# Altium project Wenzel_REF.PrjPCB (part 6 of 7)

## Sheet EEM_Connectors.SchDoc: =SheetTitle_Top
size 420 x 297 mm; EDA_Number: ARTIQ; Projet: Sensor Box; SPICEModelCacheVGBTAUBO: <root> / <DocumentId>VGBTAUBO</DocumentId> / <CacheFrame Number="0"> / <Model Name="pk14" Kind="CKT"> / <Text>*.INC dhvqfn.s / .SUBCKT pk14 / +    1   2   3   4   5   6   7   8   9  10 / +   11  12  13  14 / +   15  16  17  18  19  20  21  22  23  24 / +   25  26  27  28 / * Pin Resistance / r1 1 1001 9.078E-02 / r2 2 1002 8.829E-02 / r3 3 1003 8.731E-02 / r4 4 1004 8.710E-02 / r5 5 1005 8.731E-02 / r6 6 1006 8.829E-02 / r7 7 1007 9.075E-02 / r8 8 1008 9.072E-02 / r9 9 1009 8.809E-02 / r10 10 1010 8.716E-02 / r11 11 1011 8.706E-02 / r12 12 1012 8.720E-02 / r13 13 1013 8.816E-02 / r14 14 1014 9.068E-02 / * Pin Inductance / l1 1001 15 2.981E-09 / l2 1002 16 2.447E-09 / l3 1003 17 2.304E-09 / l4 1004 18 2.291E-09 / l5 1005 19 2.307E-09 / l6 1006 20 2.449E-09 / l7 1007 21 2.971E-09 / l8 1008 22 2.972E-09 / l9 1009 23 2.425E-09 / l10 1010 24 2.286E-09 / l11 1011 25 2.280E-09 / l12 1012 26 2.286E-09 / l13 1013 27 2.425E-09 / l14 1014 28 2.975E-09 / .ENDS pk14</Text> / </Model> / </CacheFrame> / </root>; Author: G.Kasprowicz; CompanyName: WUT ISE; DrawnBy: G.Kasprowicz; Organization: WUT ISE; Address1: PW ISE; Address2: Nowowiejska 15/19 00-665 Warsaw; Address3: gkasprow@gmail.com; Revision: 1.1; ModifiedBy: -; CheckedDate: -; Title2: EEM Connectors; DivGrp: WUT ISE; Designer: G.Kasprowicz; ModifiedDate: -; ProjectName: Sensor Box
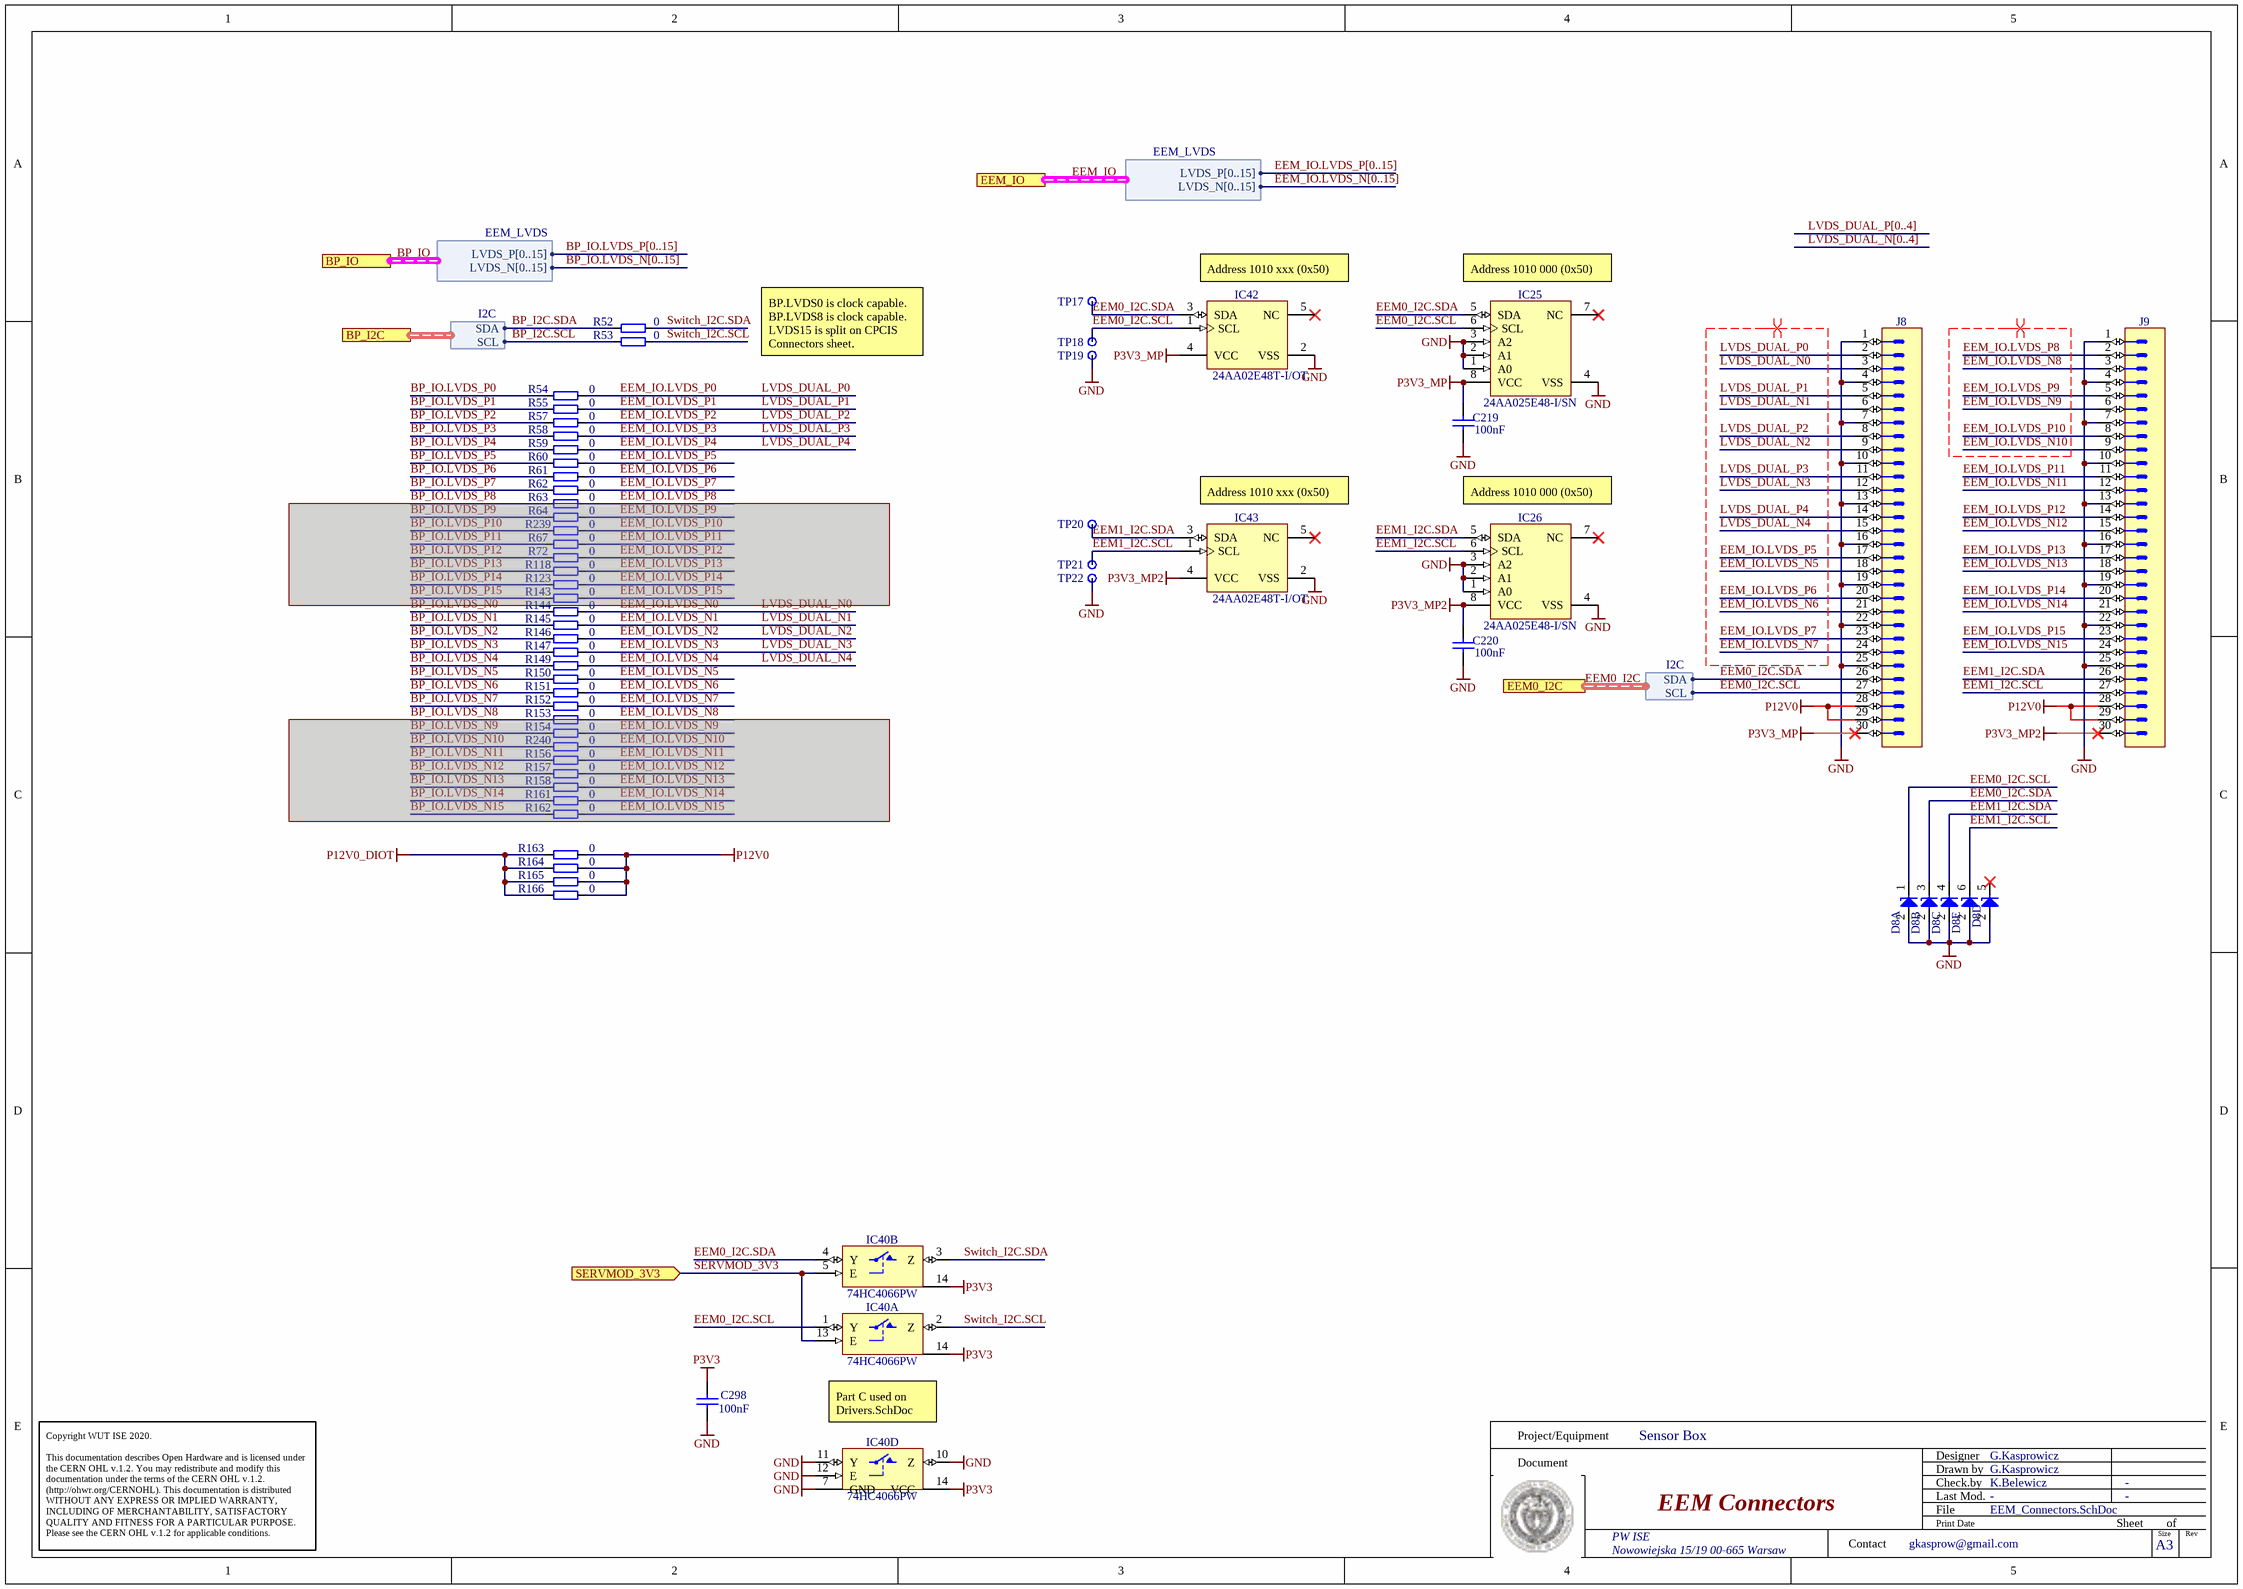
[diagram p8: EEM_Connectors.SchDoc]

### Parts
(Parts that share a designator on the sheet are numbered #1, #2 ... from top to bottom, then left to right.)
C219  100nF  [CAPC1005X55N]
C220  100nF  [CAPC1005X55N]
C298  100nF  [CAPC1005X55N]
D8  PESD3V3L5UY  [SOT65P210X110-6N]  (value not drawn)  (parts A,B,C,D,E of 5)
IC25  24AA025E48-I/SN  [SOIC127P600X175-8N]
IC26  24AA025E48-I/SN  [SOIC127P600X175-8N]
IC40  74HC4066PW  [SOP65P640X110-14N]  (parts A,B,D of 4)
IC42  24AA02E48T-I/OT  [SOT95P280X145-5N]
IC43  24AA02E48T-I/OT  [SOT95P280X145-5N]
J8  (no value)  [3M_N2530-6002RB]
J9  (no value)  [3M_N2530-6002RB]
R52  0  [RESC1005X40N]
R53  0  [RESC1005X40N]
R54  0  [RESC1005X40N]
R55  0  [RESC1005X40N]
R57  0  [RESC1005X40N]
R58  0  [RESC1005X40N]
R59  0  [RESC1005X40N]
R60  0  [RESC1005X40N]
R61  0  [RESC1005X40N]
R62  0  [RESC1005X40N]
R63  0  [RESC1005X40N]  (masked out: inside a compile mask, not in the netlist)
R64  0  [RESC1005X40N]  (masked out: inside a compile mask, not in the netlist)
R67#2  0  [RESC1005X40N]  (masked out: inside a compile mask, not in the netlist)
R72#3  0  [RESC1005X40N]  (masked out: inside a compile mask, not in the netlist)
R118#3  0  [RESC1005X40N]  (masked out: inside a compile mask, not in the netlist)
R123#2  0  [RESC1005X40N]  (masked out: inside a compile mask, not in the netlist)
R143#2  0  [RESC0603X28N]  (masked out: inside a compile mask, not in the netlist)
R144  0  [RESC1005X40N]
R145  0  [RESC1005X40N]
R146  0  [RESC1005X40N]
R147  0  [RESC1005X40N]
R149  0  [RESC1005X40N]
R150  0  [RESC1005X40N]
R151  0  [RESC1005X40N]
R152  0  [RESC1005X40N]
R153  0  [RESC1005X40N]  (masked out: inside a compile mask, not in the netlist)
R154  0  [RESC1005X40N]  (masked out: inside a compile mask, not in the netlist)
R156#1  0  [RESC1005X40N]  (masked out: inside a compile mask, not in the netlist)
R157#1  0  [RESC1005X40N]  (masked out: inside a compile mask, not in the netlist)
R158#1  0  [RESC1005X40N]  (masked out: inside a compile mask, not in the netlist)
R161#1  0  [RESC1005X40N]  (masked out: inside a compile mask, not in the netlist)
R162#1  0  [RESC0603X28N]  (masked out: inside a compile mask, not in the netlist)
R163  0  [RESC1005X40N]
R164  0  [RESC1005X40N]
R165  0  [RESC1005X40N]
R166  0  [RESC1005X40N]
R239  0  [RESC1005X40N]  (masked out: inside a compile mask, not in the netlist)
R240  0  [RESC1005X40N]  (masked out: inside a compile mask, not in the netlist)
TP17  Test Point  [TPS127]  (value not drawn)  (no BOM)
TP18  Test Point  [TPS127]  (value not drawn)  (no BOM)
TP19  Test Point  [TPS127]  (value not drawn)  (no BOM)
TP20  Test Point  [TPS127]  (value not drawn)  (no BOM)
TP21  Test Point  [TPS127]  (value not drawn)  (no BOM)
TP22  Test Point  [TPS127]  (value not drawn)  (no BOM)

### Ports
BP_I2C (harness I2C), BP_IO (harness EEM_LVDS), EEM0_I2C (harness I2C), EEM_IO (harness EEM_LVDS), SERVMOD_3V3 (in)

### Harnesses
I2C: SDA, SCL
EEM_LVDS: LVDS_P[0..15], LVDS_N[0..15]

### Nets
GND: C219.1 C220.1 C298.1 D8.2(A) IC25.1(A0) IC25.2(A1) IC25.3(A2) IC25.4(VSS) IC26.1(A0) IC26.2(A1) IC26.3(A2) IC26.4(VSS) IC40.7(GND) IC40.10(Z) IC40.11(Y) IC40.12(E) IC42.2(VSS) IC43.2(VSS) J8.1 J8.4 J8.7 J8.10 J8.13 J8.16 J8.19 J8.22 J8.25 J9.1 J9.4 J9.7 J9.10 J9.13 J9.16 J9.19 J9.22 J9.25 TP19.1 TP22.1
P3V3: C298.2 IC40.14(VCC)
P3V3_MP: C219.2 IC25.8(VCC) IC42.4(VCC) J8.30
P3V3_MP2: C220.2 IC26.8(VCC) IC43.4(VCC) J9.30
P12V0: J8.28 J8.29 J9.28 J9.29 R163.2 R164.2 R165.2 R166.2
P12V0_DIOT: R163.1 R164.1 R165.1 R166.1
BP_I2C.SCL: R53.1 ; port BP_I2C.SCL
BP_I2C.SDA: R52.1 ; port BP_I2C.SDA
BP_IO.LVDS_N0: R144.1
BP_IO.LVDS_N1: R145.1
BP_IO.LVDS_N2: R146.1
BP_IO.LVDS_N3: R147.1
BP_IO.LVDS_N4: R149.1
BP_IO.LVDS_N5: R150.1
BP_IO.LVDS_N6: R151.1
BP_IO.LVDS_N7: R152.1
BP_IO.LVDS_P0: R54.1
BP_IO.LVDS_P1: R55.1
BP_IO.LVDS_P2: R57.1
BP_IO.LVDS_P3: R58.1
BP_IO.LVDS_P4: R59.1
BP_IO.LVDS_P5: R60.1
BP_IO.LVDS_P6: R61.1
BP_IO.LVDS_P7: R62.1
EEM0_I2C.SCL: D8.1(C) IC25.6(SCL) IC40.1(Y) IC42.1(SCL) J8.27 TP18.1 ; port EEM0_I2C.SCL
EEM0_I2C.SDA: D8.3(C) IC25.5(SDA) IC40.4(Y) IC42.3(SDA) J8.26 TP17.1 ; port EEM0_I2C.SDA
EEM1_I2C.SCL: D8.6(C) IC26.6(SCL) IC43.1(SCL) J9.27 TP21.1
EEM1_I2C.SDA: D8.4(C) IC26.5(SDA) IC43.3(SDA) J9.26 TP20.1
EEM_IO.LVDS_N0: J8.3 R144.2  [also labelled LVDS_DUAL_N0]
EEM_IO.LVDS_N1: J8.6 R145.2  [also labelled LVDS_DUAL_N1]
EEM_IO.LVDS_N2: J8.9 R146.2  [also labelled LVDS_DUAL_N2]
EEM_IO.LVDS_N3: J8.12 R147.2  [also labelled LVDS_DUAL_N3]
EEM_IO.LVDS_N4: J8.15 R149.2  [also labelled LVDS_DUAL_N4]
EEM_IO.LVDS_N5: J8.18 R150.2
EEM_IO.LVDS_N6: J8.21 R151.2
EEM_IO.LVDS_N7: J8.24 R152.2
EEM_IO.LVDS_N8: J9.3  [project net DELAY_Q1_N]
EEM_IO.LVDS_N9: J9.6
EEM_IO.LVDS_N10: J9.9
EEM_IO.LVDS_N11: J9.12
EEM_IO.LVDS_N12: J9.15
EEM_IO.LVDS_N13: J9.18
EEM_IO.LVDS_N14: J9.21
EEM_IO.LVDS_N15: J9.24
EEM_IO.LVDS_P0: J8.2 R54.2  [also labelled LVDS_DUAL_P0]
EEM_IO.LVDS_P1: J8.5 R55.2  [also labelled LVDS_DUAL_P1]
EEM_IO.LVDS_P2: J8.8 R57.2  [also labelled LVDS_DUAL_P2]
EEM_IO.LVDS_P3: J8.11 R58.2  [also labelled LVDS_DUAL_P3]
EEM_IO.LVDS_P4: J8.14 R59.2  [also labelled LVDS_DUAL_P4]
EEM_IO.LVDS_P5: J8.17 R60.2
EEM_IO.LVDS_P6: J8.20 R61.2
EEM_IO.LVDS_P7: J8.23 R62.2
EEM_IO.LVDS_P8: J9.2  [project net DELAY_Q1_P]
EEM_IO.LVDS_P9: J9.5
EEM_IO.LVDS_P10: J9.8
EEM_IO.LVDS_P11: J9.11
EEM_IO.LVDS_P12: J9.14
EEM_IO.LVDS_P13: J9.17
EEM_IO.LVDS_P14: J9.20
EEM_IO.LVDS_P15: J9.23
SERVMOD_3V3: IC40.5(E) IC40.13(E) ; port SERVMOD_3V3
Switch_I2C.SCL: IC40.2(Z) R53.2
Switch_I2C.SDA: IC40.3(Z) R52.2

Not connected (* = marked no-connect by the designer): D8 5(C)*; IC25 7(NC)*; IC26 7(NC)*; IC42 5(NC)*; IC43 5(NC)*

### Buses and harness runs
bus BP_IO.LVDS_N[0..15]
bus BP_IO.LVDS_P[0..15]
bus EEM_IO.LVDS_N[0..15]
bus EEM_IO.LVDS_P[0..15]
bus LVDS_DUAL_N[0..4]
bus LVDS_DUAL_P[0..4]
harness BP_IO = port BP_IO
harness EEM0_I2C = port EEM0_I2C
harness EEM_IO = port EEM_IO

### Layout directives
differential pair; differential pair class Diff_100Ohm: EEM_IO.LVDS_N5, EEM_IO.LVDS_N6, EEM_IO.LVDS_N7, EEM_IO.LVDS_N8, EEM_IO.LVDS_N9, EEM_IO.LVDS_N10, EEM_IO.LVDS_P5, EEM_IO.LVDS_P6, EEM_IO.LVDS_P7, EEM_IO.LVDS_P8, EEM_IO.LVDS_P9, EEM_IO.LVDS_P10, LVDS_DUAL_N0, LVDS_DUAL_N1, LVDS_DUAL_N2, LVDS_DUAL_N3, LVDS_DUAL_N4, LVDS_DUAL_P0, LVDS_DUAL_P1, LVDS_DUAL_P2, LVDS_DUAL_P3, LVDS_DUAL_P4

### Notes on the sheet
- (near IC42) Address 1010 xxx (0x50)
- (near IC25) Address 1010 000 (0x50)
- BP.LVDS0 is clock capable.
  BP.LVDS8 is clock capable.
  LVDS15 is split on CPCIS Connectors sheet.
- (near IC43) Address 1010 xxx (0x50)
- Address 1010 000 (0x50)
- (near IC40) Part C used on Drivers.SchDoc
- Project/Equipment
- Document
- Designer
- Drawn by
- Check.by
- Copyright WUT ISE 2020.
  This documentation describes Open Hardware and is licensed under the CERN OHL v.1.2. You may redistribute and modify this documentation under the terms of the CERN OHL v.1.2. (http://ohwr.org/CERNOHL). This documentation is distributed WITHOUT ANY EXPRESS OR IMPLIED WARRANTY, INCLUDING OF MERCHANTABILITY, SATISFACTORY QUALITY AND FITNESS FOR A PARTICULAR PURPOSE. Please see the CERN OHL v.1.2 for applicable conditions.
- Contact
- File
- Last Mod.
- Print Date
- Sheet
- Size
- A3
- of
- Rev

### Library data of the parts
C219 C220 C298 = CC0402_100NF_16V_10%_X5R: as C1 on sheet CPCIS_Connectors; Part Number: CC0402_100NF_16V_10%_X5R; Component Kind: Standard; Component Type: Standard; Pin Count: 2; Value: 100nF; Status: None; Manufacturer Part Number: CC0402_100NF_16V_10%_X5R; Case: 0402; Mounted: Yes; Socket: No; SMD: Yes; Sense: No; Manufacturer1 Example: MURATA; Manufacturer1 ComponentHeight: 0.55mm; HelpURL: \\cern.ch\dfs\Applications\Altium\Datasheets\CC0402_X5R_MURATA_GRM.pdf; Author: CERN DEM JLC; CreateDate: 10.12.2013; LatestRevisionDate: 10.12.2013
D8 = PESD3V3L5UY: as D5 on sheet CPCIS_Connectors; Part Number: PESD3V3L5UY; Component Kind: Standard; Component Type: Standard; Device: PESD3V3L5UY; PackageDescription: SOT363, SC-88, 0.65mm Pitch; 6 Pin, 1.25mm W X 2.00mm L X 1.10mm H body, IPC Medium Density; Manufacturer Part Number: PESD3V3L5UY; Pin Count: 6; Case: SOT363; Mounted: Yes; Socket: No; SMD: Yes; Sense: No; ComponentHeight: 1.1mm; HelpURL: \\cern.ch\dfs\Applications\Altium\Datasheets\PESD3V3L5UY.pdf; Author: CERN DEM WB; CreateDate: 05.07.2021; LatestRevisionDate: 05.07.2021
IC25 IC26 = 24AA025E48-I/SN: 1.7V-5.5V, 2K I2C™ Serial EEPROMs with EUI-48™ Node Identity; Manufacturer: MICROCHIP TECHNOLOGY; PressFit: No; Bonding: No; Part Number: 24AA025E48-I/SN; Component Kind: Standard; Component Type: Standard; Device: 24AA025E48-I/SN; PackageDescription: SOIC 8, Pitch 1.27mm - Body 4x5mm, IPC Medium Density; Part Description: 1.7V-5.5V, 2K I2C™ Serial EEPROMs with EUI-48™ Node Identity; Manufacturer Part Number: 24AA025E48-I/SN; Pin Count: 8; Case: SOIC8; Mounted: Yes; Socket: No; SMD: Yes; Sense: No; ComponentHeight: 1.75mm; HelpURL: \\cern.ch\dfs\Applications\Altium\Datasheets\24AA025E48-I-SN.pdf; Author: CERN DEM MR; CreateDate: 19.07.2016; LatestRevisionDate: 19.07.2016
IC40 = 74HC4066PW: as IC6 on sheet CPCIS_Connectors; Part Number: 74HC4066PW; Component Kind: Standard; Component Type: Standard; Device: 74HC4066PW; PackageDescription: SOP, 14-Leads, Body 4.4x5mm (max), Pitch 0.65mm, IPC Medium Density; Manufacturer Part Number: 74HC4066PW; Pin Count: 14; Case: TSSOP14; Mounted: Yes; Socket: No; SMD: Yes; ComponentHeight: 1.1mm; Author: CERN DEM JLC; HelpURL: \\cern.ch\dfs\Applications\Altium\Datasheets\74HC4066PW.pdf; CreateDate: 2014-11-19; LatestRevisionDate: 2014-11-19
IC42 IC43 = 24AA02E48T-I/OT: 1.7V-5.5V, 2K I2C Serial EEPROM With EUI-48 Node Identity; Manufacturer: MICROCHIP TECHNOLOGY; PressFit: No; Bonding: No; Part Number: 24AA02E48T-I/OT; Component Kind: Standard; Component Type: Standard; Device: 24AA02E48T-I/OT; PackageDescription: SOT, 0.95mm pitch; 5 pin, 1.60mm W X 2.90mm L X 1.45mm H body, IPC Medium Density; Part Description: 1.7V-5.5V, 2K I2C Serial EEPROM With EUI-48 Node Identity; Manufacturer Part Number: 24AA02E48T-I/OT; Pin Count: 5; Case: SOT23-5; Mounted: Yes; Socket: No; SMD: Yes; Sense: No; ComponentHeight: 1.45mm; HelpURL: \\cern.ch\dfs\Applications\Altium\Datasheets\24AA02E48T-I-OT.pdf; Author: CERN DEM MR; CreateDate: 31.03.2016; LatestRevisionDate: 31.03.2016
J8 J9 = 3M_N2530-6002RB: Connector 30 Male; Part Description: 30 Contacts - Straight .100'' x .100'' Low Profile Four-Wall Header, 2500 Series; Manufacturer: 3M; PressFit: No; Part Number: 3M_N2530-6002RB; Component Kind: Standard; Component Type: Standard; Pin Count: 30; Family: Header 30; Mounted: Yes; Socket: No; SMD: No; Sense: No; Status: None; Manufacturer Part Number: N2530-6002RB; ComponentHeight: 10.03mm; HelpURL: \\cern.ch\dfs\Applications\Altium\Datasheets\3M_N2530-6002RB.pdf; Author: CERN DEM JLC; CreateDate: 11.02.2009; LatestRevisionDate: 11.08.2009
R52-R55 R57-R64 R67#2 R72#3 R118#3 R123#2 R144-R147 R149-R154 R156#1 R157#1 R158#1 R161#1 R163-R166 R239 R240 = R0402_0R_JUMPER: Resistor; Part Description: 1A (0.05R Max DC Resistance) Zero Ohm Jumper; Manufacturer: GENERIC; Manufacturer1 Part Number: 232270591001L; PressFit: No; Part Number: R0402_0R_JUMPER; Component Kind: Standard; Component Type: Standard; Pin Count: 2; Value: 0; Status: Not Recommended; Manufacturer Part Number: R0402_0R_JUMPER; Case: 0402; Mounted: Yes; Sense: No; Socket: No; SMD: Yes; Manufacturer1 Example: YAGEO PHYCOMP; Manufacturer1 ComponentHeight: 0.4mm; HelpURL: \\cern.ch\dfs\Applications\Altium\Datasheets\R0402_Phycomp_RC0402.pdf; Author: CERN DEM JLC; CreateDate: 03.12.2007; LatestRevisionDate: 17.10.2012
R143#2 R162#1 = R0201_0R_JUMPER: as R10 on sheet CPCIS_Connectors; Part Number: R0201_0R_JUMPER; Component Kind: Standard; Component Type: Standard; Pin Count: 2; Value: 0; Status: Not Recommended; Manufacturer Part Number: R0201_0R_JUMPER; Case: 0201; Mounted: Yes; Sense: No; Socket: No; SMD: Yes; Manufacturer1 Example: VISHAY; Manufacturer1 ComponentHeight: 0.27mm; HelpURL: \\cern.ch\dfs\Applications\Altium\Datasheets\R0201_VISHAY_CRCW e3.pdf; Author: CERN DEM JLC; CreateDate: 2014-11-19; LatestRevisionDate: 2015-01-08
TP17-TP22 = SMD_PAD_1.27X1.27MM: Part Description: 1.27mm x 1.27mm PCB Copper Area (SMD Test Point); Mounted: No; Part Number: SMD_PAD_1.27X1.27MM; Component Type: Standard (No BOM); Pin Count: 1; Family: Test Point; Socket: No; SMD: Yes; Sense: No; Status: None; ComponentHeight: 0mm; HelpURL: Undefined; Author: CERN DEM JLC; CreateDate: 12.01.2008; LatestRevisionDate: 12.01.2008; PackageDescription: 1.27mm x 1.27mm PCB Copper Area (SMD Test Point)

## Sheet PLL.SchDoc: =SheetTitle_Top
size 420 x 297 mm; Author: G.Kasprowicz; CompanyName: WUT ISE; DrawnBy: G.Kasprowicz; Organization: WUT ISE; Address1: PW ISE; Address2: Nowowiejska 15/19 00-665 Warsaw; Address3: gkasprow@gmail.com; Revision: 1.1; ModifiedBy: -; CheckedDate: -; Title2: PLL; DivGrp: WUT ISE; Designer: G.Kasprowicz; ModifiedDate: -; ProjectName: Sensor Box
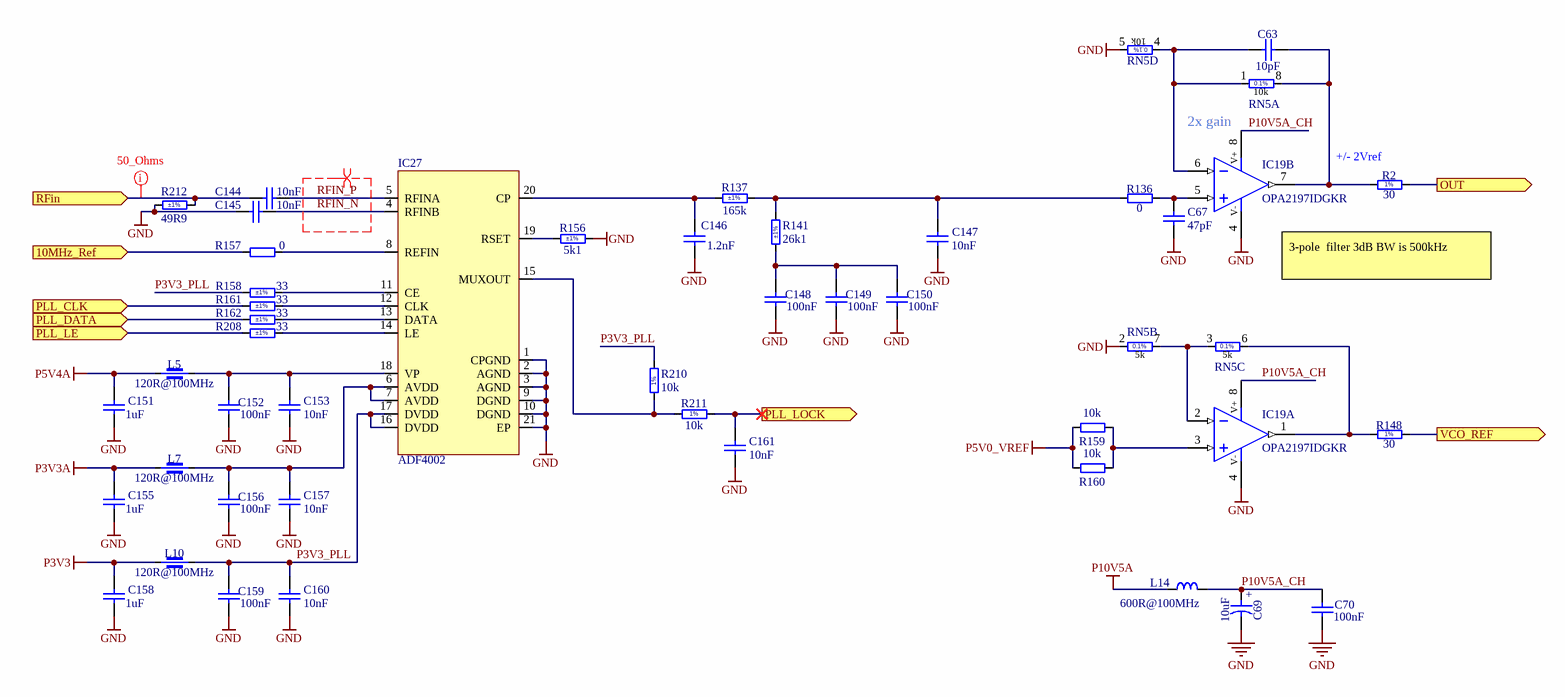
[diagram p9: PLL.SchDoc]

### Parts
(Parts that share a designator on the sheet are numbered #1, #2 ... from top to bottom, then left to right.)
C63  10pF  [CAPC1005X55N]
C67  47pF  [CAPC1005X55N]
C69  10uF  [CAPMP3216X180N]
C70  100nF  [CAPC1005X55N]
C144  10nF  [CAPC1005X55N]
C145  10nF  [CAPC1005X55N]
C146  1.2nF  [CAPC1608X87N]
C147  10nF  [CAPC1608X87N]
C148  100nF  [CAPC1005X55N]
C149  100nF  [CAPC1005X55N]
C150  100nF  [CAPC1005X55N]
C151  1uF  [CAPC1005X55N]
C152  100nF  [CAPC1005X55N]
C153  10nF  [CAPC1005X55N]
C155  1uF  [CAPC1005X55N]
C156  100nF  [CAPC1005X55N]
C157  10nF  [CAPC1005X55N]
C158  1uF  [CAPC1005X55N]
C159  100nF  [CAPC1005X55N]
C160  10nF  [CAPC1005X55N]
C161  10nF  [CAPC1005X55N]
IC19  OPA2197IDGKR  [SOP65P490X110-8N]  (parts A,B of 2)
IC27  ADF4002  [CP_20_1_ADI]
L5  120R@100MHz  [INDC1608X65N]
L7  120R@100MHz  [INDC1608X65N]
L10  120R@100MHz  [INDC1608X65N]
L14  600R@100MHz  [INDC1005X55N]
R2  30  [RESC1608X55N]
R136  0  [RESC1005X40N]
R137#2  165k  Tolerance: ±1%  [RESC1608X55N]
R141  26k1  Tolerance: ±1%  [RESC1608X55N]
R148  30  [RESC1608X55N]
R156#2  5k1  Tolerance: ±1%  [RESC1608X55N]
R157#2  0  [RESC1005X40N]
R158#2  33  Tolerance: ±1%  [RESC1005X40N]
R159  10k  [RESC1608X55N]
R160  10k  [RESC1608X55N]
R161#2  33  Tolerance: ±1%  [RESC1005X40N]
R162#2  33  Tolerance: ±1%  [RESC1005X40N]
R208#2  33  Tolerance: ±1%  [RESC1005X40N]
R210  10k  [RESC1005X40N]
R211#2  10k  [RESC1005X40N]
R212#2  49R9  Tolerance: ±1%  [RESC1005X40N]
RN5  10k 5K 5K 10K  [SOIC127P600X175-8N]  (value not drawn)  (parts A,B,C,D of 4)

### Ports
10MHz_Ref (in), OUT (out), PLL_CLK (in), PLL_DATA (in), PLL_LE (in), PLL_LOCK (out), RFin (in), VCO_REF (out)

### Nets
GND: C67.2 C69.2 C70.1 C145.1 C146.1 C147.1 C148.1 C149.1 C150.1 C151.1 C152.1 C153.1 C155.1 C156.1 C157.1 C158.1 C159.1 C160.1 C161.2 IC19.4(V-) IC27.1(CPGND) IC27.2(AGND) IC27.3(AGND) IC27.9(DGND) IC27.10(DGND) IC27.21(EP) R156#2.2 R212#2.1 RN5.2 RN5.5
P3V3: C158.2 L10.1
P3V3A: C155.2 L7.1
P5V0_VREF: R159.2 R160.2
P5V4A: C151.2 L5.1
P10V5A: L14.1
10MHz_Ref: R157#2.1 ; port 10MHz_Ref
D4: C161.1 R211#2.2 ; port PLL_LOCK
D11: R208#2.1 ; port PLL_LE
D15 (SCK): R161#2.1 ; port PLL_CLK
P3V3_PLL: C159.2 C160.2 IC27.16(DVDD) IC27.17(DVDD) L10.2 R158#2.1 R210.2
P10V5A_CH: C69.1 C70.2 IC19.8(V+) L14.2
PLL_MOSI: R162#2.1 ; port PLL_DATA
RF_100M: C144.1 R212#2.2 ; port RFin
RFIN_N: C145.2 IC27.4(RFINB)
RFIN_P: C144.2 IC27.5(RFINA)
VCO_IN: R2.2 ; port OUT
VCO_REF_IN: R148.2 ; port VCO_REF
NetC63_1: C63.1 IC19.6(IN-) RN5.1 RN5.4
NetC63_2: C63.2 IC19.7(OUT) R2.1 RN5.8
NetC67_1: C67.1 IC19.5(IN+) R136.2
NetC146_2: C146.2 IC27.20(CP) R137#2.1
NetC147_2: C147.2 R136.1 R137#2.2 R141.2
NetC148_2: C148.2 C149.2 C150.2 R141.1
NetC152_2: C152.2 C153.2 IC27.18(VP) L5.2
NetC156_2: C156.2 C157.2 IC27.6(AVDD) IC27.7(AVDD) L7.2
NetIC19_1: IC19.1(OUT) R148.1 RN5.6
NetIC19_2: IC19.2(IN-) RN5.3 RN5.7
NetIC19_3: IC19.3(IN+) R159.1 R160.1
NetIC27_8: IC27.8(REFIN) R157#2.2
NetIC27_11: IC27.11(CE) R158#2.2
NetIC27_12: IC27.12(CLK) R161#2.2
NetIC27_13: IC27.13(DATA) R162#2.2
NetIC27_14: IC27.14(LE) R208#2.2
NetIC27_15: IC27.15(MUXOUT) R210.1 R211#2.1
NetIC27_19: IC27.19(RSET) R156#2.1

### Layout directives
differential pair: RFIN_N, RFIN_P
net class 50_Ohms: RF_100M

### Notes on the sheet
- 2x gain
- (near R2) +/- 2Vref
- (near IC19) 3-pole  filter 3dB BW is 500kHz
- Project/Equipment
- Document
- Designer
- Drawn by
- Check.by
- Copyright WUT ISE 2020.
  This documentation describes Open Hardware and is licensed under the CERN OHL v.1.2. You may redistribute and modify this documentation under the terms of the CERN OHL v.1.2. (http://ohwr.org/CERNOHL). This documentation is distributed WITHOUT ANY EXPRESS OR IMPLIED WARRANTY, INCLUDING OF MERCHANTABILITY, SATISFACTORY QUALITY AND FITNESS FOR A PARTICULAR PURPOSE. Please see the CERN OHL v.1.2 for applicable conditions.
- Contact
- File
- Last Mod.
- Print Date
- Sheet
- Size
- A3
- of
- Rev
- (in symbol CTE3216-18_10UF_16V_20%_AVX_TCJ) +
- (in symbol R0402_10K_1%_0.0625W_100PPM) 1%
- (in symbol R0603_30R_1%_0.1W_100PPM) 1%
- (in symbol RN_10K_5K_VISHAY_AORN2-1AT3, part A) 10k
- (in symbol RN_10K_5K_VISHAY_AORN2-1AT3, part B) 5k
- (in symbol RN_10K_5K_VISHAY_AORN2-1AT3, part C) 5k
- (in symbol RN_10K_5K_VISHAY_AORN2-1AT3, part D) 10k

### Library data of the parts
C63 = CC0402_10PF_50V_5%_C0G: Non-polarised capacitor; Part Description: SMD Multilayer Chip Ceramic Capacitor; Manufacturer: GENERIC; Manufacturer1 Part Number: C0402C100J5GACTU; Voltage: 50V; TC: C0G/NP0; Tolerance: ±5%; Part Number: CC0402_10PF_50V_5%_C0G; Component Kind: Standard; Component Type: Standard; Pin Count: 2; Value: 10pF; Status: Preferred; Manufacturer Part Number: CC0402_10PF_50V_5%_C0G; Case: 0402; Mounted: Yes; Socket: No; SMD: Yes; Sense: No; Manufacturer1 Example: KEMET; Manufacturer1 ComponentHeight: 0.55mm; HelpURL: \\cern.ch\dfs\Applications\Altium\Datasheets\CC0805_C0G_KEMET_(Commercial Grade).pdf; Author: CERN DEM JLC; CreateDate: 03.12.2007; LatestRevisionDate: 22.04.2015
C67 = CC0402_47PF_50V_1%_C0G_MURATA_GJM1555C1H470FB01D: Non-polarised capacitor; Part Description: High-Q SMD Chip Monolithic Ceramic Capacitor; Manufacturer: MURATA; Voltage: 50V; TC: C0G/NP0; Tolerance: ±1%; Part Number: CC0402_47PF_50V_1%_C0G_MURATA_GJM1555C1H470FB01D; Component Kind: Standard; Component Type: Standard; Pin Count: 2; Value: 47pF; Status: None; Manufacturer Part Number: GJM1555C1H470FB01D; Case: 0402; Mounted: Yes; Socket: No; SMD: Yes; Sense: No; ComponentHeight: 0.55mm; HelpURL: \\cern.ch\dfs\Applications\Altium\Datasheets\CC0402_MURATA_GJM1555C1H470FB01D.pdf; Author: CERN DEM BC; CreateDate: 20.11.2017; LatestRevisionDate: 20.11.2017
C69 = CTE3216-18_10UF_16V_20%_AVX_TCJ: Polarised capacitor; Part Description: ESR 0R200 Tantalum Solid Electrolytic Chip Capacitor with Conductive Polymer Electrode; Manufacturer: AVX; Manufacturer Part Number: TCJA106M016R0200 or  or TR3A106K016C1700; Voltage: 16V; Tolerance: ±20%; Part Number: CTE3216-18_10UF_16V_20%_AVX_TCJ; Component Kind: Standard; Component Type: Standard; Pin Count: 2; Value: 10uF; Status: Preferred; Case: A; Mounted: Yes; Socket: No; SMD: Yes; Sense: No; ComponentHeight: 1.8mm; HelpURL: \\cern.ch\dfs\Applications\Altium\Datasheets\CTE_AVX_TCJ.pdf; Author: CERN DEM JLC; CreateDate: 29.03.2012; LatestRevisionDate: 29.03.2012
C70 C148-C150 C152 C156 C159 = CC0402_100NF_16V_10%_X5R: as C1 on sheet CPCIS_Connectors; Part Number: CC0402_100NF_16V_10%_X5R; Component Kind: Standard; Component Type: Standard; Pin Count: 2; Value: 100nF; Status: None; Manufacturer Part Number: CC0402_100NF_16V_10%_X5R; Case: 0402; Mounted: Yes; Socket: No; SMD: Yes; Sense: No; Manufacturer1 Example: MURATA; Manufacturer1 ComponentHeight: 0.55mm; HelpURL: \\cern.ch\dfs\Applications\Altium\Datasheets\CC0402_X5R_MURATA_GRM.pdf; Author: CERN DEM JLC; CreateDate: 10.12.2013; LatestRevisionDate: 10.12.2013
C144 C145 C153 C157 C160 C161 = CC0402_10NF_16V_10%_X7R: Non-polarised capacitor; Part Description: SMD Multilayer Chip Ceramic Capacitor; Manufacturer: GENERIC; Manufacturer1 Part Number: 223878715636; Voltage: 16V; TC: X7R; Tolerance: ±10%; Part Number: CC0402_10NF_16V_10%_X7R; Component Kind: Standard; Component Type: Standard; Pin Count: 2; Value: 10nF; Status: Not Recommended; Manufacturer Part Number: CC0402_10NF_16V_10%_X7R; Case: 0402; Mounted: Yes; Socket: No; SMD: Yes; Sense: No; Manufacturer1 Example: PHYCOMP; Manufacturer1 ComponentHeight: 0.55mm; HelpURL: \\cern.ch\dfs\Applications\Altium\Datasheets\CC0402_X7R_PHYCOMP.pdf; Author: CERN DEM JLC; CreateDate: 03.12.2007; LatestRevisionDate: 03.12.2007
C146 = CC0603_1.2NF_50V_1%_C0G: Non-polarised capacitor; Part Description: SMD Multilayer Chip Ceramic Capacitor; Manufacturer: GENERIC; Manufacturer1 Part Number: C0603C122F5GACTU; Voltage: 50V; TC: C0G/NP0; Tolerance: ±1%; Part Number: CC0603_1.2NF_50V_1%_C0G; Component Kind: Standard; Component Type: Standard; Pin Count: 2; Value: 1.2nF; Status: None; Manufacturer Part Number: CC0603_1.2NF_50V_1%_C0G; Case: 0603; Mounted: Yes; Socket: No; SMD: Yes; Sense: No; Manufacturer1 Example: KEMET; Manufacturer1 ComponentHeight: 0.87mm; HelpURL: \\cern.ch\dfs\Applications\Altium\Datasheets\CC0603_C0G_KEMET_(Commercial Grade).pdf; Author: CERN DEM BC; CreateDate: 21/05/2019; LatestRevisionDate: 21/05/2019
C147 = CC0603_10NF_50V_5%_C0G: Non-polarised capacitor; Part Description: SMD Multilayer Chip Ceramic Capacitor; Manufacturer: GENERIC; Manufacturer1 Part Number: C1608C0G1H103J080AA; Voltage: 50V; TC: C0G/NP0; Tolerance: ±5%; Part Number: CC0603_10NF_50V_5%_C0G; Component Kind: Standard; Component Type: Standard; Pin Count: 2; Value: 10nF; Status: Preferred; Manufacturer Part Number: CC0603_10NF_50V_5%_C0G; Case: 0603; Mounted: Yes; Socket: No; SMD: Yes; Sense: No; Manufacturer1 Example: TDK; Manufacturer1 ComponentHeight: 0.9mm; HelpURL: \\cern.ch\dfs\Applications\Altium\Datasheets\CC0603_C0G_TDK_C.pdf; Author: CERN DEM JLC; CreateDate: 10/12/2014; LatestRevisionDate: 10/12/2014
C151 C155 C158 = CC0402_1UF_16V_10%_X5R: as C12 on sheet CPCIS_Connectors; Part Number: CC0402_1UF_16V_10%_X5R; Component Kind: Standard; Component Type: Standard; Pin Count: 2; Value: 1uF; Status: Preferred; Manufacturer Part Number: CC0402_1UF_16V_10%_X5R; Case: 0402; Mounted: Yes; Socket: No; SMD: Yes; Sense: No; Manufacturer1 Example: TDK; Manufacturer1 ComponentHeight: 0.55mm; HelpURL: \\cern.ch\dfs\Applications\Altium\Datasheets\CC0402_X5R_TDK_C.pdf; Author: CERN DEM JLC; CreateDate: 2012-10-25; LatestRevisionDate: 2012-10-25
IC19 = OA_OPA2197IDGKR: 36-V, Precision, Rail-to-Rail Input Output, Low Offset Voltage Op Amp 8-VSSOP; Part Description: High-Precision, Low-Noise, Rail-to-Rail Output,10-MHz Op Amp; Manufacturer: TEXAS INSTRUMENTS; PressFit: No; Bonding: No; Part Number: OPA2197IDGKR; Component Kind: Standard; Component Type: Standard; Device: OPA2197IDGKR; PackageDescription: SOP, 0.65mm pitch; 8 pin, 3.00mm W X 3.00mm L X 1.10mm H body, IPC Medium Density; Manufacturer Part Number: OPA2197IDGKR; Pin Count: 8; Case: MSOP8; Mounted: Yes; Socket: No; SMD: Yes; Sense: No; ComponentHeight: 1.1mm; Author: GK; HelpURL: \\cern.ch\dfs\Applications\Altium\Datasheets\OPA2140AIDGK.pdf; CreateDate: 20.04.2017; LatestRevisionDate: 20.04.2017
IC27 = ADF4002BCPZ-RL7: No Description Available; Manufacturer: Analog Devices Inc; Part Number: ADF4002BCPZ-RL7; Manufacturer Part Number: ADF4002BCPZ-RL7
L5 L7 L10 = IND0603_MURATA_BLM18SG121TN1D: Part Description: SMD EMIFIL Suppression Chip Ferrite Bead; Manufacturer: MURATA; Power: 3A; Resistance: 0.025R; Tolerance: ±25%; Part Number: IND0603_MURATA_BLM18SG121TN1D; Component Kind: Standard; Component Type: Standard; Pin Count: 2; Value: 120R@100MHz; Manufacturer Part Number: BLM18SG121TN1D; Case: 0603; Mounted: Yes; Socket: No; SMD: Yes; Sense: No; ComponentHeight: 0.65mm; HelpURL: \\cern.ch\dfs\Applications\Altium\Datasheets\IND0603_MURATA_BLM18S.pdf; Author: CERN DEM JLC; CreateDate: 23.07.2014; LatestRevisionDate: 25.10.2018
L14 = IND0402_MURATA_BLM15HD601SN1: Inductor; Part Description: SMD EMIFIL Suppression Chip Ferrite Bead; Manufacturer: MURATA; Manufacturer Part Number: BLM15HD601SN1D; Power: 300mA; Resistance: 0.85R; Tolerance: ±25%; Part Number: IND0402_MURATA_BLM15HD601SN1; Component Kind: Standard; Component Type: Standard; Pin Count: 2; Value: 600R@100MHz; Status: None; Case: 0402; Mounted: Yes; Socket: No; SMD: Yes; Sense: No; ComponentHeight: 0.55mm; HelpURL: \\cern.ch\dfs\Applications\Altium\Datasheets\IND0402_MURATA_BLM15H.pdf; Author: CERN DEM JLC; CreateDate: 28/02/2012; LatestRevisionDate: 28/02/2012
R2 R148 = R0603_30R_1%_0.1W_100PPM: Resistor - 1%; Part Description: General Purpose Thick Film Chip Resistor; Manufacturer: GENERIC; Manufacturer1 Part Number: NRC06F30R0TRF; Power: 0.1W; TC: ±100ppm/°C; PressFit: No; Part Number: R0603_30R_1%_0.1W_100PPM; Component Kind: Standard; Component Type: Standard; Pin Count: 2; Value: 30; Status: Preferred; Tolerance: ±1%; Manufacturer Part Number: R0603_30R_1%_0.1W_100PPM; Case: 0603; Mounted: Yes; Sense: No; Socket: No; SMD: Yes; Manufacturer1 Example: NIC COMPONENT; Manufacturer1 ComponentHeight: 0.55mm; HelpURL: \\cern.ch\dfs\Applications\Altium\Datasheets\R0603_NIC_NRC.pdf; Author: CERN DEM JLC; CreateDate: 03/12/2007; LatestRevisionDate: 13/03/2008
R136 R157#2 = R0402_0R_JUMPER: as R52-R55 on sheet EEM_Connectors; Part Number: R0402_0R_JUMPER; Component Kind: Standard; Component Type: Standard; Pin Count: 2; Value: 0; Status: Not Recommended; Manufacturer Part Number: R0402_0R_JUMPER; Case: 0402; Mounted: Yes; Sense: No; Socket: No; SMD: Yes; Manufacturer1 Example: YAGEO PHYCOMP; Manufacturer1 ComponentHeight: 0.4mm; HelpURL: \\cern.ch\dfs\Applications\Altium\Datasheets\R0402_Phycomp_RC0402.pdf; Author: CERN DEM JLC; CreateDate: 03.12.2007; LatestRevisionDate: 17.10.2012
R137#2 = R0402_165K_1%_0.1W_50PPM: Resistor - 1%; Part Description: General Purpose Thick Film Chip Resistor; Manufacturer: GENERIC; Manufacturer1 Part Number: RT0402FRE07165KL; Power: 0.1W; TC: ±100ppm/°C; PressFit: No; Part Number: R0402_165K_1%_0.1W_50PPM; Component Kind: Standard; Component Type: Standard; Pin Count: 2; Value: 165k; Status: Preferred; Manufacturer Part Number: R0402_165K_1%_0.1W_50PPM; Case: 0603; Mounted: Yes; Sense: No; Socket: No; SMD: Yes; Manufacturer1 Example: YAGEO; Manufacturer1 ComponentHeight: 0.55mm; HelpURL: \\cern.ch\dfs\Applications\Altium\Datasheets\R0603_NIC_NRC.pdf; Author: CERN DEM JLC; CreateDate: 03.12.2007; LatestRevisionDate: 13.03.2008
R141 = R0603_26K1_1%_0.1W_50PPM: Resistor - 1%; Part Description: General Purpose Thick Film Chip Resistor; Manufacturer: GENERIC; Manufacturer1 Part Number: RT0603FRE0726K1L; Power: 0.1W; TC: ±100ppm/°C; PressFit: No; Part Number: R0603_26K1_1%_0.1W_50PPM; Component Kind: Standard; Component Type: Standard; Pin Count: 2; Value: 26k1; Status: Preferred; Manufacturer Part Number: R0603_26K1_1%_0.1W_50PPM; Case: 0603; Mounted: Yes; Sense: No; Socket: No; SMD: Yes; Manufacturer1 Example: YAGEO; Manufacturer1 ComponentHeight: 0.55mm; HelpURL: \\cern.ch\dfs\Applications\Altium\Datasheets\R0603_NIC_NRC.pdf; Author: CERN DEM JLC; CreateDate: 03.12.2007; LatestRevisionDate: 13.03.2008
R156#2 = R0603_5K1_1%_0.1W_100PPM: Resistor - 1%; Part Description: General Purpose Thick Film Chip Resistor; Manufacturer: GENERIC; Manufacturer1 Part Number: NRC06F5101TRF; Power: 0.1W; TC: ±100ppm/°C; PressFit: No; Part Number: R0603_5K1_1%_0.1W_100PPM; Component Kind: Standard; Component Type: Standard; Pin Count: 2; Value: 5k1; Status: Preferred; Manufacturer Part Number: R0603_5K1_1%_0.1W_100PPM; Case: 0603; Mounted: Yes; Sense: No; Socket: No; SMD: Yes; Manufacturer1 Example: NIC COMPONENT; Manufacturer1 ComponentHeight: 0.55mm; HelpURL: \\cern.ch\dfs\Applications\Altium\Datasheets\R0603_NIC_NRC.pdf; Author: CERN DEM JLC; CreateDate: 03.12.2007; LatestRevisionDate: 13.03.2008
R158#2 R161#2 R162#2 R208#2 = R0402_33R_1%_0.0625W_100PPM: Resistor - 1%; Part Description: General Purpose Thick Film Chip Resistor; Manufacturer: GENERIC; Manufacturer1 Part Number: 232270673309L; TC: ±100ppm/°C; PressFit: No; Part Number: R0402_33R_1%_0.0625W_100PPM; Component Kind: Standard; Component Type: Standard; Pin Count: 2; Value: 33; Status: Not Recommended; Power: 0.0625W; Manufacturer Part Number: R0402_33R_1%_0.0625W_100PPM; Case: 0402; Mounted: Yes; Sense: No; Socket: No; SMD: Yes; Manufacturer1 Example: YAGEO PHYCOMP; Manufacturer1 ComponentHeight: 0.4mm; HelpURL: \\cern.ch\dfs\Applications\Altium\Datasheets\R0402_Phycomp_RC0402.pdf; Author: CERN DEM JLC; CreateDate: 03.12.2007; LatestRevisionDate: 17.10.2012
R159 R160 = R0603_10K_1%_0.1W_100PPM: as R218 on sheet CPCIS_Connectors; Part Number: R0603_10K_1%_0.1W_100PPM; Component Kind: Standard; Component Type: Standard; Pin Count: 2; Value: 10k; Status: Preferred; Tolerance: ±1%; Manufacturer Part Number: R0603_10K_1%_0.1W_100PPM; Case: 0603; Mounted: Yes; Sense: No; Socket: No; SMD: Yes; Manufacturer1 Example: NIC COMPONENT; Manufacturer1 ComponentHeight: 0.55mm; HelpURL: \\cern.ch\dfs\Applications\Altium\Datasheets\R0603_NIC_NRC.pdf; Author: CERN DEM JLC; CreateDate: 03.12.2007; LatestRevisionDate: 13.03.2008
R210 R211#2 = R0402_10K_1%_0.0625W_100PPM: as R30 on sheet CPCIS_Connectors; Part Number: R0402_10K_1%_0.0625W_100PPM; Component Kind: Standard; Component Type: Standard; Pin Count: 2; Value: 10k; Status: Not Recommended; Power: 0.0625W; Tolerance: ±1%; Manufacturer Part Number: R0402_10K_1%_0.0625W_100PPM; Case: 0402; Mounted: Yes; Sense: No; Socket: No; SMD: Yes; Manufacturer1 Example: YAGEO PHYCOMP; Manufacturer1 ComponentHeight: 0.4mm; HelpURL: \\cern.ch\dfs\Applications\Altium\Datasheets\R0402_Phycomp_RC0402.pdf; Author: CERN DEM JLC; CreateDate: 03.12.2007; LatestRevisionDate: 17.10.2012
R212#2 = R0402_49R9_1%_0.0625W_100PPM: Resistor - 1%; Part Description: General Purpose Thick Film Chip Resistor; Manufacturer: GENERIC; Manufacturer1 Part Number: 232270674999L or RC0402FR-0749R9L; TC: ±100ppm/°C; PressFit: No; Part Number: R0402_49R9_1%_0.0625W_100PPM; Component Kind: Standard; Component Type: Standard; Pin Count: 2; Value: 49R9; Status: Not Recommended; Power: 0.0625W; Manufacturer Part Number: R0402_49R9_1%_0.0625W_100PPM; Case: 0402; Mounted: Yes; Sense: No; Socket: No; SMD: Yes; Manufacturer1 Example: YAGEO PHYCOMP; Manufacturer1 ComponentHeight: 0.4mm; HelpURL: \\cern.ch\dfs\Applications\Altium\Datasheets\R0402_Phycomp_RC0402.pdf; Author: CERN DEM JLC; CreateDate: 24.10.2012; LatestRevisionDate: 24.10.2012
RN5 = RN_10K_5K_VISHAY_AORN2-1AT3: DIL8 Resistor Network 4 Resistors 10k-5k-5k-10k 0.1%; Part Description: Dual-In-Line Thin Film Precision Automotive Resistors Network, (4 Isolated) - AORN Series; Manufacturer: VISHAY DALE; Power: 4x0.1W; TC: ±25ppm/°C; PressFit: No; Part Number: RN_10K_5K_VISHAY_AORN2-1AT3; Component Kind: Standard; Component Type: Standard; Pin Count: 8; Value: 10k 5K 5K 10K; Sense: No; Tolerance: 0.1%; Manufacturer Part Number: AORN2-1AT3; Case: SOIC8; Mounted: Yes; Socket: No; SMD: Yes; ComponentHeight: 1.73mm; HelpURL: \\cern.ch\dfs\Applications\Altium\Datasheets\RN_VISHAY_AORN.pdf; Author: CERN DEM JLC; CreateDate: 20.02.2017; LatestRevisionDate: 20.02.2017